# EasyEDA Pro project ProPrj_Practice 4 layer_2025-09-09.epro, schematic Analog Inputs
Board Name: 4 Analog Inputs; Create Date: 2025-08-15; Page Name: P1; Project Name: Practice 4 layer; Schematic Name: Analog Inputs; Update Date: 2025-08-20; Company: EasyEDA.com; Page Size: A4; Version: V1.0
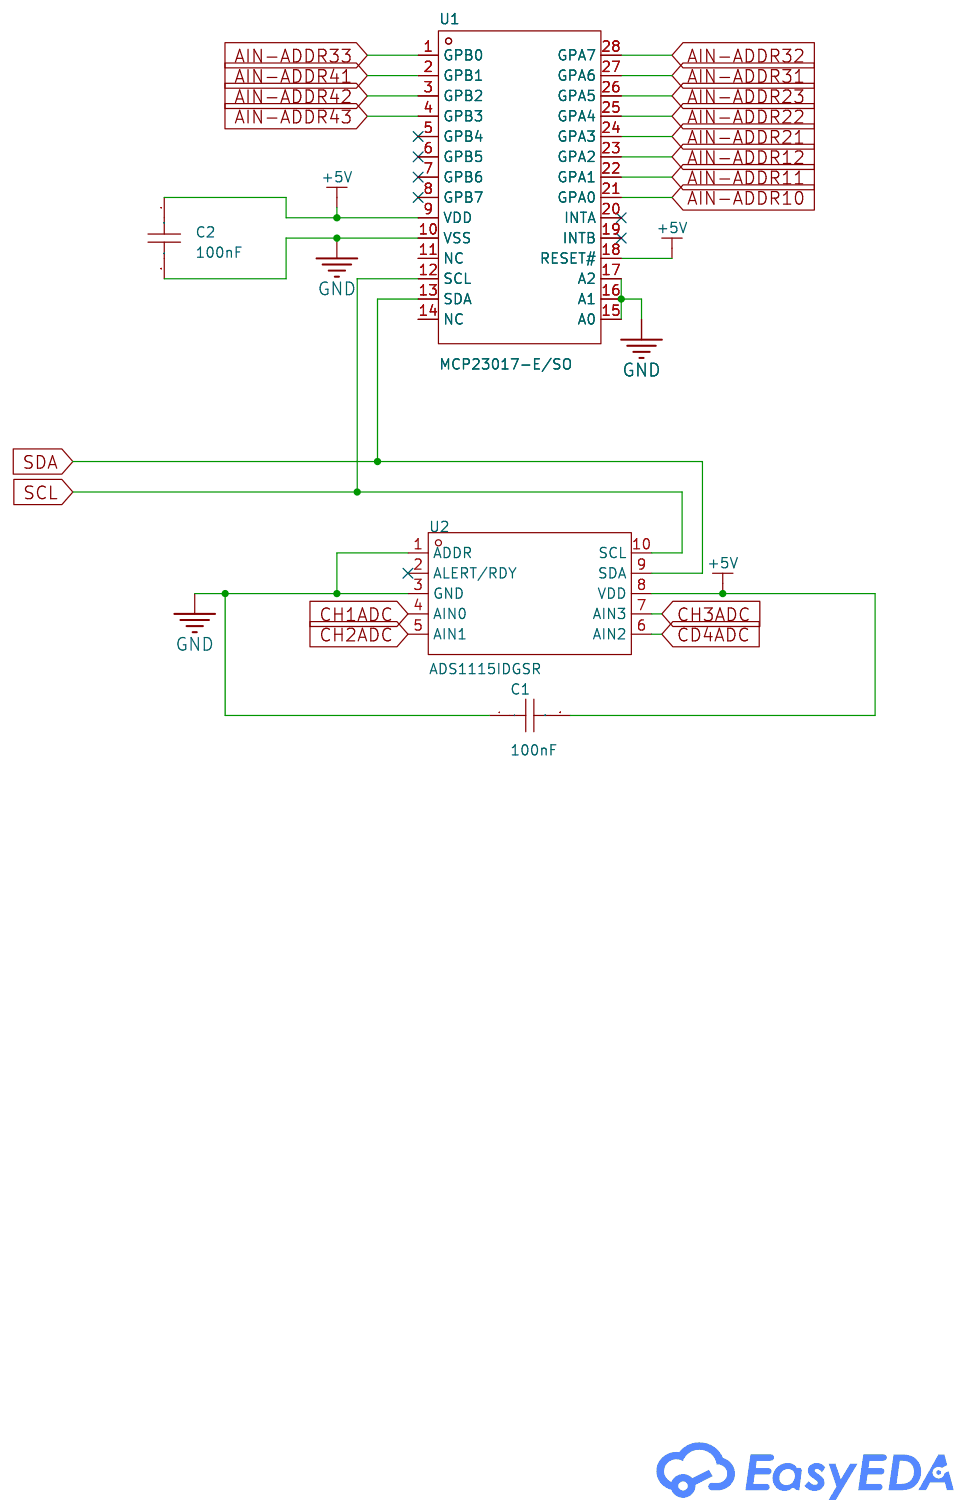
[diagram p4: schematic sheet]

## Parts
C1  100nF  [C0603]
C2  100nF  [C0603]
U1  MCP23017-E/SO  [SOIC-28_L18.0-W7.5-P1.27-LS10.3-BL]
U2  ADS1115IDGSR  [MSOP-10_L3.0-W3.0-P0.50-LS5.0-BL]

## Library data of the parts
C1 C2 = CC0603KRX7R9BB104: Capacitance:100nF Tolerance:±10% Tolerance:±10% Voltage Rating:50V Temperature Coefficient:X7R; LCSC Part Name: 100nF ±10% 50V; Supplier Part: C14663; Manufacturer: YAGEO(国巨); Supplier Footprint: 0603; JLCPCB Part Class: Basic Part; Datasheet: https://atta.szlcsc.com/upload/public/pdf/source/20250214/096C4C206003071F5D32E5F0D8E7F8DF.pdf; Supplier: LCSC; Tolerance: ±10%; Voltage Rating: 50V; Temperature Coefficient: X7R
U1 = MCP23017-E/SO: Interface:- Number of I/O:16 Interrupt Output:With Interrupt Output Output Type:- Voltage - Supply:1.8V~5.5V Voltage - Supply:1.8V~5.5V Current - Output Low(IOL):- Current - Output High(IOH):- Clock Frequency:1.7MHz Operating Temperature:-40℃~+85℃ Operati; LCSC Part Name: 16位I/O扩展器带串行接口; Supplier Part: C47023; Manufacturer: MICROCHIP(美国微芯); Supplier Footprint: SOIC-28-300mil; JLCPCB Part Class: Extended Part; Datasheet: https://atta.szlcsc.com/upload/public/pdf/source/20221209/1BF939F88C2D907BC056D7BF485E3103.pdf; Supplier: LCSC; Number of I/O: 16; Interrupt Output: With Interrupt Output; Voltage - Supply: 1.8V~5.5V; Clock Frequency: 1.7MHz; Operating Temperature: -40℃~+85℃
U2 = ADS1115IDGSR: Resolution(Bits):16Bit Sampling Rate:- number of channels:4 Voltage - Supply:2V~5.5V Voltage - Supply:2V~5.5V Interface:I2C differential input:- Integral non - linearity:1LSB Integral non - linearity:1LSB Operating Temperature:-40℃~+125℃ Operating Tempera; LCSC Part Name: 具有内部基准、振荡器和可编程比较器且兼容 I2C 的ADS111x、超小型、低功耗 860SPS、16位ADC; Supplier Part: C37593; Manufacturer: TI(德州仪器); Supplier Footprint: VSSOP-10; JLCPCB Part Class: Extended Part; Datasheet: https://www.ti.com/cn/lit/gpn/ads1115; Supplier: LCSC; Resolution(Bits): 16Bit; number of channels: 4; Voltage - Supply: 2V~5.5V; Interface: I2C; Integral non - linearity: 1LSB; Operating Temperature: -40℃~+125℃

## Nets
+5V: C1.2 C2.1 U1.9(VDD) U1.18(RESET#) U2.8(VDD)
GND: C1.1 C2.2 U1.10(VSS) U1.15(A0) U1.16(A1) U1.17(A2) U2.1(ADDR) U2.3(GND)
AIN-ADDR10: U1.21(GPA0)
AIN-ADDR11: U1.22(GPA1)
AIN-ADDR12: U1.23(GPA2)
AIN-ADDR21: U1.24(GPA3)
AIN-ADDR22: U1.25(GPA4)
AIN-ADDR23: U1.26(GPA5)
AIN-ADDR31: U1.27(GPA6)
AIN-ADDR32: U1.28(GPA7)
AIN-ADDR33: U1.1(GPB0)
AIN-ADDR41: U1.2(GPB1)
AIN-ADDR42: U1.3(GPB2)
AIN-ADDR43: U1.4(GPB3)
CD4ADC: U2.6(AIN2)
CH1ADC: U2.4(AIN0)
CH2ADC: U2.5(AIN1)
CH3ADC: U2.7(AIN3)
SCL: U1.12(SCL) U2.10(SCL)
SDA: U1.13(SDA) U2.9(SDA)

Not connected (* = marked no-connect by the designer): U1 5(GPB4)* 6(GPB5)* 7(GPB6)* 8(GPB7)* 11(NC) 14(NC) 19(INTB)* 20(INTA)*; U2 2(ALERT/RDY)*
